# Altium schematic sheet power_regulation.SchDoc
size 381 x 241 mm; SheetNumber: 17; SheetTotal: 17
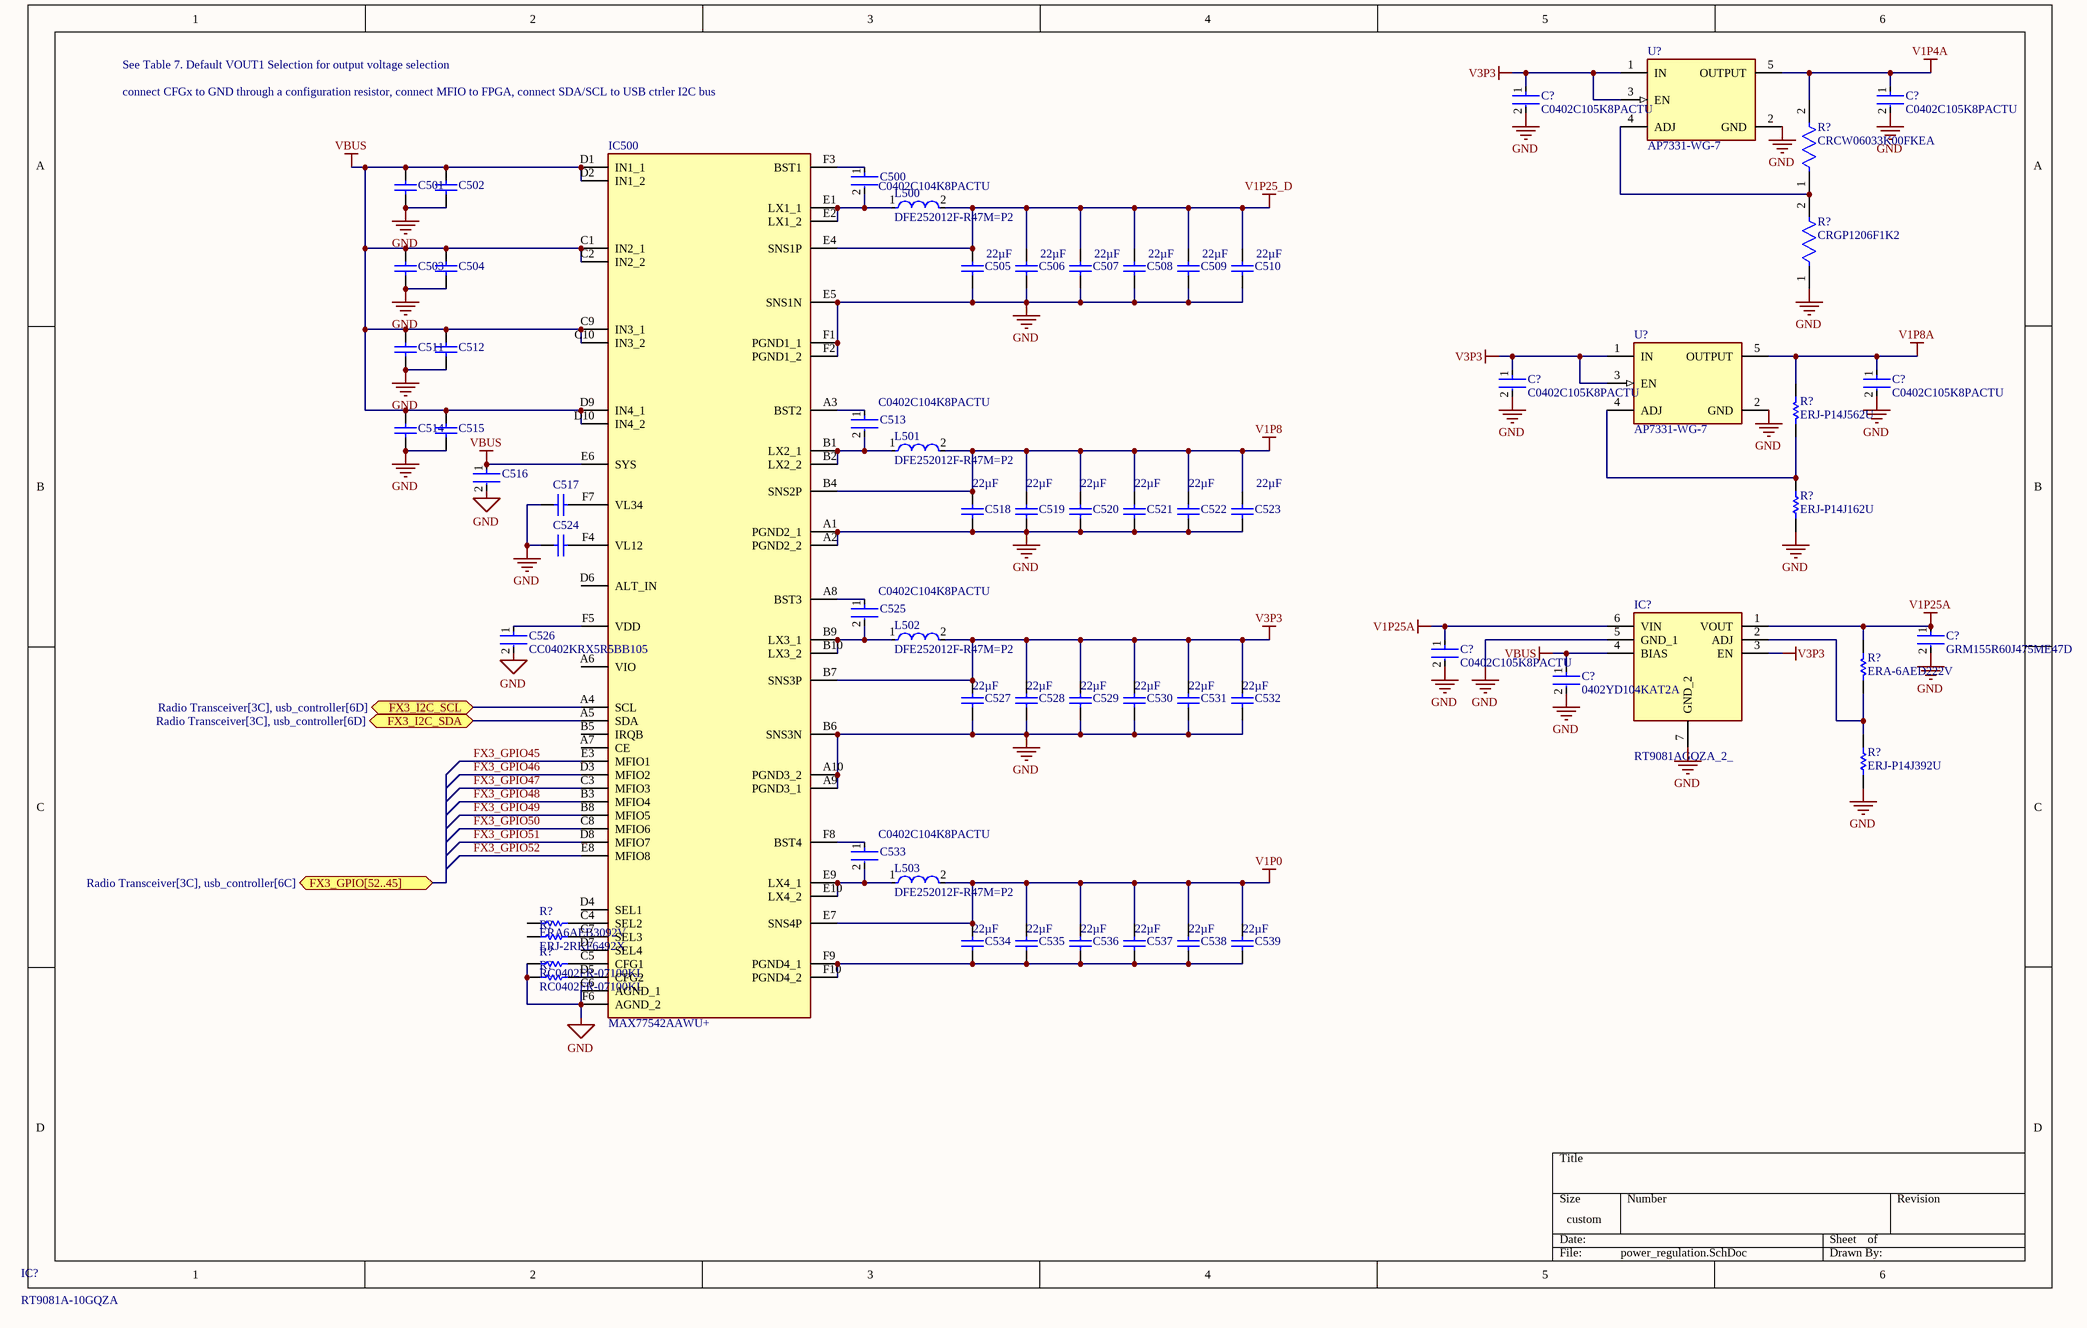
[diagram p0: power_regulation.SchDoc]

## Parts
(Parts that share a designator on the sheet are numbered #1, #2 ... from top to bottom, then left to right.)
C500  C0402C104K8PACTU  [FP-C0402-BB-MFG]
C501  C0603C105K3RACTU  [CAPC1608X87X35LL15T15]  (value not drawn)
C502  C0603C105K3RACTU  [CAPC1608X87X35LL15T15]  (value not drawn)
C503  C0603C105K3RACTU  [CAPC1608X87X35LL15T15]  (value not drawn)
C504  C0603C105K3RACTU  [CAPC1608X87X35LL15T15]  (value not drawn)
C505  Capacitance: 22µF  [CAPC1608X100X20ML10]  (hidden comment: C1608X5R1A226M080AC)
C506  Capacitance: 22µF  [CAPC1608X100X20ML10]  (hidden comment: C1608X5R1A226M080AC)
C507  Capacitance: 22µF  [CAPC1608X100X20ML10]  (hidden comment: C1608X5R1A226M080AC)
C508  Capacitance: 22µF  [CAPC1608X100X20ML10]  (hidden comment: C1608X5R1A226M080AC)
C509  Capacitance: 22µF  [CAPC1608X100X20ML10]  (hidden comment: C1608X5R1A226M080AC)
C510  Capacitance: 22µF  [CAPC1608X100X20ML10]  (hidden comment: C1608X5R1A226M080AC)
C511  C0603C105K3RACTU  [CAPC1608X87X35LL15T15]  (value not drawn)
C512  C0603C105K3RACTU  [CAPC1608X87X35LL15T15]  (value not drawn)
C513  C0402C104K8PACTU  [FP-C0402-BB-MFG]
C514  C0603C105K3RACTU  [CAPC1608X87X35LL15T15]  (value not drawn)
C515  C0603C105K3RACTU  [CAPC1608X87X35LL15T15]  (value not drawn)
C516  GRT155R61E225KE13D  [FP-GRT155-0_2-IPC_C]  (value not drawn)
C517  C0402C225K9PACTU  [CAPC1005X60X30NL05T10]  (value not drawn)
C518  Capacitance: 22µF  [CAPC1608X100X20ML10]  (hidden comment: C1608X5R1A226M080AC)
C519  Capacitance: 22µF  [CAPC1608X100X20ML10]  (hidden comment: C1608X5R1A226M080AC)
C520  Capacitance: 22µF  [CAPC1608X100X20ML10]  (hidden comment: C1608X5R1A226M080AC)
C521  Capacitance: 22µF  [CAPC1608X100X20ML10]  (hidden comment: C1608X5R1A226M080AC)
C522  Capacitance: 22µF  [CAPC1608X100X20ML10]  (hidden comment: C1608X5R1A226M080AC)
C523  Capacitance: 22µF  [CAPC1608X100X20ML10]  (hidden comment: C1608X5R1A226M080AC)
C524  C0402C225K9PACTU  [CAPC1005X60X30NL05T10]  (value not drawn)
C525  C0402C104K8PACTU  [FP-C0402-BB-MFG]
C526  CC0402KRX5R5BB105  [FP-CC0402-MFG]
C527  Capacitance: 22µF  [CAPC1608X100X20ML10]  (hidden comment: C1608X5R1A226M080AC)
C528  Capacitance: 22µF  [CAPC1608X100X20ML10]  (hidden comment: C1608X5R1A226M080AC)
C529  Capacitance: 22µF  [CAPC1608X100X20ML10]  (hidden comment: C1608X5R1A226M080AC)
C530  Capacitance: 22µF  [CAPC1608X100X20ML10]  (hidden comment: C1608X5R1A226M080AC)
C531  Capacitance: 22µF  [CAPC1608X100X20ML10]  (hidden comment: C1608X5R1A226M080AC)
C532  Capacitance: 22µF  [CAPC1608X100X20ML10]  (hidden comment: C1608X5R1A226M080AC)
C533  C0402C104K8PACTU  [FP-C0402-BB-MFG]
C534  Capacitance: 22µF  [CAPC1608X100X20ML10]  (hidden comment: C1608X5R1A226M080AC)
C535  Capacitance: 22µF  [CAPC1608X100X20ML10]  (hidden comment: C1608X5R1A226M080AC)
C536  Capacitance: 22µF  [CAPC1608X100X20ML10]  (hidden comment: C1608X5R1A226M080AC)
C537  Capacitance: 22µF  [CAPC1608X100X20ML10]  (hidden comment: C1608X5R1A226M080AC)
C538  Capacitance: 22µF  [CAPC1608X100X20ML10]  (hidden comment: C1608X5R1A226M080AC)
C539  Capacitance: 22µF  [CAPC1608X100X20ML10]  (hidden comment: C1608X5R1A226M080AC)
C?#1  C0402C105K8PACTU  [FP-C0402C105K8PACTU-MFG]
C?#2  C0402C105K8PACTU  [FP-C0402C105K8PACTU-MFG]
C?#3  C0402C105K8PACTU  [FP-C0402C105K8PACTU-MFG]
C?#4  C0402C105K8PACTU  [FP-C0402C105K8PACTU-MFG]
C?#5  GRM155R60J475ME47D  [FP-GRM155-0_1-IPC_B]
C?#6  C0402C105K8PACTU  [FP-C0402C105K8PACTU-MFG]
C?#7  0402YD104KAT2A  [FP-0402-L_1_0_1-W_0_5_0_1-IPC_B]
IC500  MAX77542AAWU+  [BGA60C40P10X6_436X256X69]
IC?#1  RT9081AGQZA_2_  [SON40P120X120X32-7N-D]
IC?#2  RT9081A-10GQZA  [SON40P120X120X32-7N-D]
L500  DFE252012F-R47M=P2  [FP-DFE252012C-MFG]
L501  DFE252012F-R47M=P2  [FP-DFE252012C-MFG]
L502  DFE252012F-R47M=P2  [FP-DFE252012C-MFG]
L503  DFE252012F-R47M=P2  [FP-DFE252012C-MFG]
R?#1  CRCW06033K00FKEA  [FP-CRCW0603-e3-MFG]
R?#2  CRGP1206F1K2  [FP-CRGP1206-IPC_C]
R?#3  ERJ-P14J562U  [RESC3225X70X50ML20T20]
R?#4  ERJ-P14J162U  [RESC3225X70X50NL20T20]
R?#5  ERA-6AED222V  [RESC2013X60X40NL20T25]
R?#6  ERJ-P14J392U  [RESC3225X70X50LL20T20]
R?#7  ERA6AEB3092V  [RESC2013X60X40NL20T25]
R?#8  ERJ-2RKF6492X  [RESC1005X40X25ML05T05]
R?#9  RC0402FR-07100KL  [RESC1005X40X25NL05T10]
R?#10  RC0402FR-07100KL  [RESC1005X40X25NL05T10]
U?#1  AP7331-WG-7  [FP-SOT25-MFG]
U?#2  AP7331-WG-7  [FP-SOT25-MFG]

## Ports
FX3_GPIO[52..45] (bidir, see Radio Transceiver[3C], usb_controller[6C]), FX3_I2C_SCL (bidir, see Radio Transceiver[3C], usb_controller[6D]), FX3_I2C_SDA (bidir, see Radio Transceiver[3C], usb_controller[6D])

## Nets
GND: C501.1 C502.1 C503.1 C504.1 C505.1 C506.1 C507.1 C508.1 C509.1 C510.1 C511.1 C512.1 C514.1 C515.1 C516.2 C517.1 C518.1 C519.1 C520.1 C521.1 C522.1 C523.1 C524.1 C526.2 C527.1 C528.1 C529.1 C530.1 C531.1 C532.1 C?#1.2 C?#2.2 C?#3.2 C?#4.2 C?#5.2 C?#6.2 C?#7.2 IC500.A1(PGND2_1) IC500.A2(PGND2_2) IC500.A9(PGND3_1) IC500.A10(PGND3_2) IC500.B6(SNS3N) IC500.C6(AGND_1) IC500.E5(SNS1N) IC500.F1(PGND1_1) IC500.F2(PGND1_2) IC500.F6(AGND_2) IC?#1.5(GND_1) IC?#1.7(GND_2) R?#2.1 R?#4.1 R?#6.1 R?#9.1 R?#10.1 U?#1.2(GND) U?#2.2(GND)
V1P0: C534.2 C535.2 C536.2 C537.2 C538.2 C539.2 IC500.E7(SNS4P) L503.2
V1P4A: C?#2.1 R?#1.2 U?#1.5(OUTPUT)
V1P8: C518.2 C519.2 C520.2 C521.2 C522.2 C523.2 IC500.B4(SNS2P) L501.2
V1P8A: C?#4.1 R?#3.1 U?#2.5(OUTPUT)
V1P25_D: C505.2 C506.2 C507.2 C508.2 C509.2 C510.2 IC500.E4(SNS1P) L500.2
V1P25A: C?#5.1 C?#6.1 IC?#1.1(VOUT) IC?#1.6(VIN) R?#5.1
V3P3: C527.2 C528.2 C529.2 C530.2 C531.2 C532.2 C?#1.1 C?#3.1 IC500.B7(SNS3P) IC?#1.3(EN) L502.2 U?#1.1(IN) U?#1.3(EN) U?#2.1(IN) U?#2.3(EN)
VBUS: C501.2 C502.2 C503.2 C504.2 C511.2 C512.2 C514.2 C515.2 C516.1 C?#7.1 IC500.C1(IN2_1) IC500.C2(IN2_2) IC500.C9(IN3_1) IC500.C10(IN3_2) IC500.D1(IN1_1) IC500.D2(IN1_2) IC500.D9(IN4_1) IC500.D10(IN4_2) IC500.E6(SYS) IC?#1.4(BIAS)
FX3_GPIO45: IC500.E3(MFIO1)
FX3_GPIO46: IC500.D3(MFIO2)
FX3_GPIO47: IC500.C3(MFIO3)
FX3_GPIO48: IC500.B3(MFIO4)
FX3_GPIO49: IC500.B8(MFIO5)
FX3_GPIO50: IC500.C8(MFIO6)
FX3_GPIO51: IC500.D8(MFIO7)
FX3_GPIO52: IC500.E8(MFIO8)
FX3_I2C_SCL: IC500.A4(SCL) ; port FX3_I2C_SCL
FX3_I2C_SDA: IC500.A5(SDA) ; port FX3_I2C_SDA
NetC500_1: C500.1 IC500.F3(BST1)
NetC500_2: C500.2 IC500.E1(LX1_1) IC500.E2(LX1_2) L500.1
NetC513_1: C513.1 IC500.A3(BST2)
NetC513_2: C513.2 IC500.B1(LX2_1) IC500.B2(LX2_2) L501.1
NetC517_2: C517.2 IC500.F7(VL34)
NetC524_2: C524.2 IC500.F4(VL12)
NetC525_1: C525.1 IC500.A8(BST3)
NetC525_2: C525.2 IC500.B9(LX3_1) IC500.B10(LX3_2) L502.1
NetC526_1: C526.1 IC500.F5(VDD)
NetC533_1: C533.1 IC500.F8(BST4)
NetC533_2: C533.2 IC500.E9(LX4_1) IC500.E10(LX4_2) L503.1
NetC534_1: C534.1 C535.1 C536.1 C537.1 C538.1 C539.1 IC500.F9(PGND4_1) IC500.F10(PGND4_2)
NetIC500_C4: IC500.C4(SEL2) R?#7.2
NetIC500_C5: IC500.C5(CFG1) R?#9.2
NetIC500_C7: IC500.C7(SEL3) R?#8.2
NetIC500_D5: IC500.D5(CFG2) R?#10.2
NetIC?#1_2: IC?#1.2(ADJ) R?#5.2 R?#6.2
NetR?#1_1: R?#1.1 R?#2.2 U?#1.4(ADJ)
NetR?#3_2: R?#3.2 R?#4.2 U?#2.4(ADJ)

Not connected (* = marked no-connect by the designer): IC500 A6(VIO) A7(CE) B5(IRQB) D4(SEL1) D6(ALT_IN) D7(SEL4); R?#7 1; R?#8 1

## Notes on the sheet
- connect CFGx to GND through a configuration resistor, connect MFIO to FPGA, connect SDA/SCL to USB ctrler I2C bus
- See Table 7. Default VOUT1 Selection for output voltage selection

## Library data of the parts
C500 = CMP-2008-02046-2: CAP CER 0.1UF 10V X5R 0402; Manufacturer: Kemet; Material: Ceramic; Capacitance: 0.10 μF; Temperature Coefficient: 15%; Tolerance: 0.1; Value: 1p; Package: C0402-BB; Temperature: -55°C to +125°C; ComponentLink2Description: Datasheet; Temperature Characteristic: X5R; Device Class L1: Passive Components; Height: 0.55mm; Lead Free: Yes; ComponentLink2URL: https://content.kemet.com/datasheets/KEM_C1002_X7R_SMD.pdf; Device Class L2: Capacitors; Temperature Range Low: -55°C; Temperature Range High: +125°C; RoHS: TRUE; Octopart: https://octopart.com/c0402c104k8pactu-kemet-140039; Automotive: No; Mouser Description: Capacitor 100 nF 10 VDC 0402; Category: Cap; Voltage Rating: 10 V; Digikey Description: CAP CER 0.1UF 10V X5R 0402; Ipc Land Pattern Name: CAPC10050X50; Device Class L3: Ceramic Capacitors; Manufacturer Part Number: C0402C104K8PACTU
C501-C504 C511 C512 C514 C515 = CMP-2006-03713-1: Manufacturer: Kemet; Part Number: C0603C105K3RACTU
C505-C510 C518-C523 C527-C532 C534-C539 = CMP-2000-05441-1: Chip Capacitor, 22 uF, +/- 20%, 10 V, -55 to 85 degC, 0603 (1608 Metric), RoHS, Tape and Reel; Manufacturer: TDK; PCN Part Number: MLCCPartNumberChange30/Nov/2012; Voltage - Rated: 10V; Product Training Modules: CSeriesGeneralApplicationsSEAT,CCV,andTVCLDesignToolsGuidetoReplacinganElectrolyticCapacitorwithanMLCC; Other Names: 445-9077-1; Design Resources: 20WNon-IsolatedBuckLEDDriverUsingPLLNK460KG; Online Catalog: CSeries,GeneralPurpose; Temperature Coefficient: X5R; Kits: 445-9014-KIT-ND-KITMLCC100PF-22UF060310-50V; Value: 22µF; Packaging: CutTape(CT); Standard Package: 1; Package / Case: 0603(1608Metric); Lead Style: -; Features: -; Ratings: -; Operating Temperature: -55degC~85degC; Applications: GeneralPurpose; Package Reference: 603; Datasheet URL: http://download.siliconexpert.com/pdfs/2015/4/21/15/54/45/779/tdk_/manual/37024850441143360mlcc_commercial_general_en.pdf; Datasheet Version: Mar-15; Mounting Type: SurfaceMount,MLCC; Lead Spacing: -; Size / Dimension: 0.063"Lx0.031"W(1.60mmx0.80mm); Height - Seated (Max): -; Package Description: 2-Pin Surface Mount Device, Body 1.6 x 0.8 mm; Manufacturer URL: http://www.tdk.com/; RoHS Information: RoHSCertificate-MLCC; Tolerance: ±20%; Series: C; Thickness (Max): 0.035"(0.90mm); Family: CeramicCapacitors; Category: Capacitors
C513 C525 C533 = CMP-2008-02046-2: CAP CER 0.1UF 10V X5R 0402; Manufacturer: Kemet; Material: Ceramic; Capacitance: 0.10 μF; Temperature Coefficient: 15%; Tolerance: 0.1; Value: 0.10 μF; Package: C0402-BB; Temperature: -55°C to +125°C; ComponentLink2Description: Datasheet; Temperature Characteristic: X5R; Device Class L1: Passive Components; Height: 0.55mm; Lead Free: Yes; ComponentLink2URL: https://content.kemet.com/datasheets/KEM_C1002_X7R_SMD.pdf; Device Class L2: Capacitors; Temperature Range Low: -55°C; Temperature Range High: +125°C; RoHS: TRUE; Octopart: https://octopart.com/c0402c104k8pactu-kemet-140039; Automotive: No; Mouser Description: Capacitor 100 nF 10 VDC 0402; Category: Cap; Voltage Rating: 10 V; Digikey Description: CAP CER 0.1UF 10V X5R 0402; Ipc Land Pattern Name: CAPC10050X50; Device Class L3: Ceramic Capacitors; Manufacturer Part Number: C0402C104K8PACTU
C516 = CMP-06035-059281-1: Multi-Layer Ceramic Capacitor 2.2uF 25V X5R ±10% 0402 Paper T/R; Max Operating Temperature: 85°C; Case Code (Imperial): 0402; Width: 0.02inch; Min Operating Temperature: -55°C; Voltage Rating (DC): 25V; Tolerance: 10%; Length: 0.039inch; Ratings: AEC-Q200; Dielectric: X5R; Case Code (Metric): 1005; Thickness: 0.022inch; Voltage Rating: 25V; Packaging: Cut Tape; Case/Package: 0402; Mount: Surface Mount; Capacitance: 2.2uF; Value: 2.2uF
C517 C524 = CMP-2008-02055-1: Manufacturer: Kemet; Part Number: C0402C225K9PACTU
C526 = CMP-2100-03591-2: CAP CER 1UF 6.3V X5R 0402; Manufacturer: YAGEO; Automotive Grade: NA; Material: Ceramic; Tolerance: 0.1; Temperature Coefficient: 30ppm/°C; Voltage Rating: 6.3 V; Temperature Range Low: -55°C; Digikey Description: CAP CER 1UF 6.3V X5R 0402; Capacitance: 1 uF; Height: 0.55mm; Automotive: No; ComponentLink2URL: http://www.yageo.com/documents/recent/UPY-GP_NP0_16V-to-50V_16.pdf; Device Class L2: Capacitors; RoHS: TRUE; Temperature Range High: +125°C; Device Class L3: Ceramic Capacitors; Device Class L1: Passive Components; Temperature Characteristic: X5R; Package: CC0402; Octopart: https://octopart.com/cc0402krx5r5bb105-yageo-42244618; ComponentLink2Description: Datasheet; Temperature: -55°C to +125°C; Manufacturer Part Number: CC0402KRX5R5BB105; Mouser Description: Multilayer Ceramic Capacitors MLCC - SMD/SMT 1uF 6.3V X5R 10%; Category: Cap; Footprint Url: http://www.yageo.com/exep/pages/download/literatures/UPY-C_GEN_24.pdf; Lead Free: Yes; Ipc Land Pattern Name: CAPC10050X50; Value: 1 uF
C?#1-C?#4 C?#6 = CMP-2008-02081-2: CAP CER 1UF 10V X5R 0402; Dielectric Material: Ceramic; Dissipation Factor: 5%; Tolerance: 10%; Number of Pins: 2; Contact Plating: Tin; Min Operating Temperature: -55°C; Termination: SMD/SMT; Lead Free: Lead Free; Construction: Flat; Voltage Rating (DC): 10V; Mount: Surface Mount; Series: C; Thickness: 0.022inch; Width: 0.5mm; Radiation Hardening: No; Capacitance: 1uF; Dielectric: X5R; Height: 0.5mm; Voltage: 10V; Length: 1mm; Depth: 0.5mm; Max Operating Temperature: 85°C; Package Quantity: 1; Packaging: Tape and Reel; RoHS Compliant: Yes; Case Code (Imperial): 0402; Case Code (Metric): 1005; REACH SVHC: No SVHC; Voltage Rating: 10V; Case/Package: 0402
C?#5 = CMP-2008-04549-2: Chip Multilayer Ceramic Capacitors for General Purpose, 0402, 4.7uF, X5R, 15%, 20%, 6.3V; Height: 0.5mm; Weight: 0.000212oz; Length: 1mm; Case Code (Metric): 1005; Packaging: Tape and Reel; Termination: SMD/SMT; Dielectric: X5R; Depth: 0.5mm; Case Code (Imperial): 0402; Min Operating Temperature: -55°C; Case/Package: 0402; Voltage: 6.3V; Width: 0.02inch; Capacitance: 4.7uF; Lead Free: Lead Free; Thickness: 0.022inch; Contact Plating: Tin; REACH SVHC: No SVHC; Package Quantity: 10000; Tolerance: 20%; Voltage Rating (DC): 6.3V; Voltage Rating: 6.3V; Mount: Surface Mount; Max Operating Temperature: 85°C
C?#7 = CMP-2008-02842-2: General Purpose Ceramic Capacitor, 0402, 100nF, 10%, X5R, 15%, 16V; Dissipation Factor: 3.5%; Case Code (Metric): 1005; Packaging: Tape and Reel; Voltage Rating: 16V; Voltage: 16V; REACH SVHC: No SVHC; Width: 0.02inch; Thickness: 0.022inch; Max Operating Temperature: 85°C; Dielectric: X5R; Mount: Surface Mount; Package Quantity: 1; Length: 1mm; Termination: SMD/SMT; Voltage Rating (DC): 16V; Construction: Flat; Contact Plating: Tin; Depth: 0.5mm; Tolerance: 10%; RoHS Compliant: Yes; Min Operating Temperature: -55°C; Case Code (Imperial): 0402; Capacitance: 100nF; Height: 0.56mm; Case/Package: 0402; Radiation Hardening: No; Lead Free: Lead Free; Series: -
IC500 = MAX77542AAWU+: Integrated Circuit; Manufacturer_Name: Analog Devices; Datasheet Link: https://www.analog.com/MAX77542/datasheet; Height: 0.69mm; Manufacturer_Part_Number: MAX77542AAWU+
IC?#1 = RT9081AGQZA_2_: Integrated Circuit; Manufacturer_Name: RICHTEK; Manufacturer_Part_Number: RT9081AGQZA(2); Datasheet Link: https://componentsearchengine.com/Datasheets/2/RT9081AGQZA(2).pdf; Height: 0.32mm
IC?#2 = RT9081A-10GQZA: Integrated Circuit; Manufacturer_Name: RICHTEK; Datasheet Link: https://datasheet.datasheetarchive.com/originals/distributors/DKDS-18/355839.pdf; Height: 0.32mm; Manufacturer_Part_Number: RT9081A-10GQZA; Mouser Part Number: 835-RT9081A-10GQZA; Mouser Price/Stock: https://www.mouser.co.uk/ProductDetail/Richtek/RT9081A-10GQZA?qs=P%2FxahI%252BVehnQcAK2RIexiw%3D%3D
L500-L503 = CMP-06042-001570-1: Shielded Wirewound Inductor 0.47uH 20% 4900mA 0.023Ω 1008 (2520); Current Rating: 4.9A; Inductance: 470nH; DC Resistance (DCR): 23mR; Core Material: Ferrite; Saturation Current: 7.4A; Test Frequency: 1MHz; Value: 470nH; Height - Seated (Max): 0.047inch; Case Code (Imperial): 1008; Packaging: Cut Tape; Min Operating Temperature: -40°C; Max Operating Temperature: 125°C; Tolerance: 20%; Length: 0.098inch; Width: 0.079inch; Mount: Surface Mount; Case Code (Metric): 2520; Shielding: Shielded; Case/Package: 1008
R?#1 = CMP-2000-03293-2: RES Thick Film, 3kΩ, 1%, 0.1W, 100ppm/°C, 0603; Voltage Rating: 75V; Resistance: 3kR; Power Rating: 100mW; Features: Automotive AEC-Q200; Radiation Hardening: No; Contact Plating: Tin; Termination: SMD/SMT; Lead Free: Lead Free; Case Code (Imperial): 0603; Case Code (Metric): 1608; Case/Package: 0603; Depth: 0.85mm; Mount: Surface Mount; Voltage Rating (DC): 75V; Tolerance: 1%; Package Quantity: 10; Temperature Coefficient: 100ppm/°C; Height: 0.45mm; Max Power Dissipation: 100mW; Composition: Thick Film; Max Operating Temperature: 155°C; Military Standard: Not; Weight: 7.1E-05oz; Length: 1.55mm; Packaging: Tape and Reel; Number of Terminations: 2; Width: 0.85mm; Min Operating Temperature: -55°C
R?#2 = CMP-03211-005809-1: CRGP1206 1.2KΩ 0.5W ±100ppm/°C 1% 200V; Manufacturer: TE; Tolerance: 0.01; Temperature Range High: +155°C; Temperature Coefficient: ±100ppm/°C; Lead Free: Yes; Device Class L2: Resistors; Resistance: 1.2KΩ; Voltage Rating: 200V; Power Rating: 0.5W; Automotive: No; RoHS: TRUE; Ipc Land Pattern Name: RESC310155X55; Category: Res; Manufacturer Part Number: CRGP1206F1K2; Series: CRGP; ComponentLink2Description: Datasheet; Value: 1.2KΩ; Octopart: https://octopart.com/crgp1206f1k2-te+connectivity-91018858; Temperature Range Low: -55°C; Package: CRGP1206; Device Class L1: Passive Components; Device Class L3: Chip SMD Resistors; Composition: Thick Film; Height: 0.65mm; Ambient Temperature Range High: +70°C; ComponentLink2URL: https://www.mouser.com/datasheet/2/418/NG_DS_9-1773463-9_A-1358566.pdf; Temperature: -55°C to +155°C
R?#3 = CMP-2005-03750-1: Manufacturer: Panasonic; Part Number: ERJ-P14J562U
R?#4 = CMP-2005-03668-1: Manufacturer: Panasonic; Part Number: ERJ-P14J162U
R?#5 = CMP-2001-00686-1: Manufacturer: Panasonic; Part Number: ERA-6AED222V
R?#6 = CMP-2005-03724-1: Manufacturer: Panasonic; Part Number: ERJ-P14J392U
R?#7 = CMP-2001-00796-1: Manufacturer: Panasonic; Part Number: ERA6AEB3092V
R?#8 = CMP-2002-01029-1: Manufacturer: Panasonic; Part Number: ERJ-2RKF6492X
R?#9 R?#10 = CMP-2002-07343-1: Manufacturer: Yageo / Phycomp; Part Number: RC0402FR-07100KL
U?#1 U?#2 = CMP-12756-000022-1: IC REG LIN POS ADJ 300MA SOT25; Manufacturer: Diodes Inc.; Dropout Voltage: 300mV; Nominal Supply Current: 55-65uA; Standoff Height: 0.013mm; Output Voltage: 0.8-5V; Min Supply Voltage: 2V; Number Of Outputs: 1; Max Supply Voltage: 6V; Output Type: AdjustableProgrammable; Accuracy Percentage: 2%; Max Junction Temp: +150°C; Max Power Dissipation: 640mW; RoHS: TRUE; ComponentLink2URL: https://www.diodes.com/assets/Datasheets/AP7331.pdf; Package: SOT25; Category: IC; Temperature Range Low: -40°C; ComponentLink2Description: Datasheet; Automotive: No; Device Class L3: Voltage Regulators - Linear; Mouser Description: AP7331 Series 0.8 - 5 V ADJ Output 300 mA LDO Linear Regulator - SOT-25; Device Class L2: Power Management ICs; Temperature Range High: +125°C; Lead Free: Yes; Footprint Url: https://www.diodes.com/assets/Package-Files/SOT25.pdf; Manufacturer Part Number: AP7331-WG-7; Device Class L1: Integrated Circuits (ICs); Octopart: https://octopart.com/ap7331-wg-7-diodes+inc.-17930424; Ambient Temperature Range Low: -40°C; Output Current: 300mA; Height: 1.4mm; Ambient Temperature Range High: +85°C; Temperature: -40°C to +125°C; Digikey Description: IC REG LIN POS ADJ 300MA SOT25